# EAGLE design sm200-bob-v00 (EAGLE 5.11)
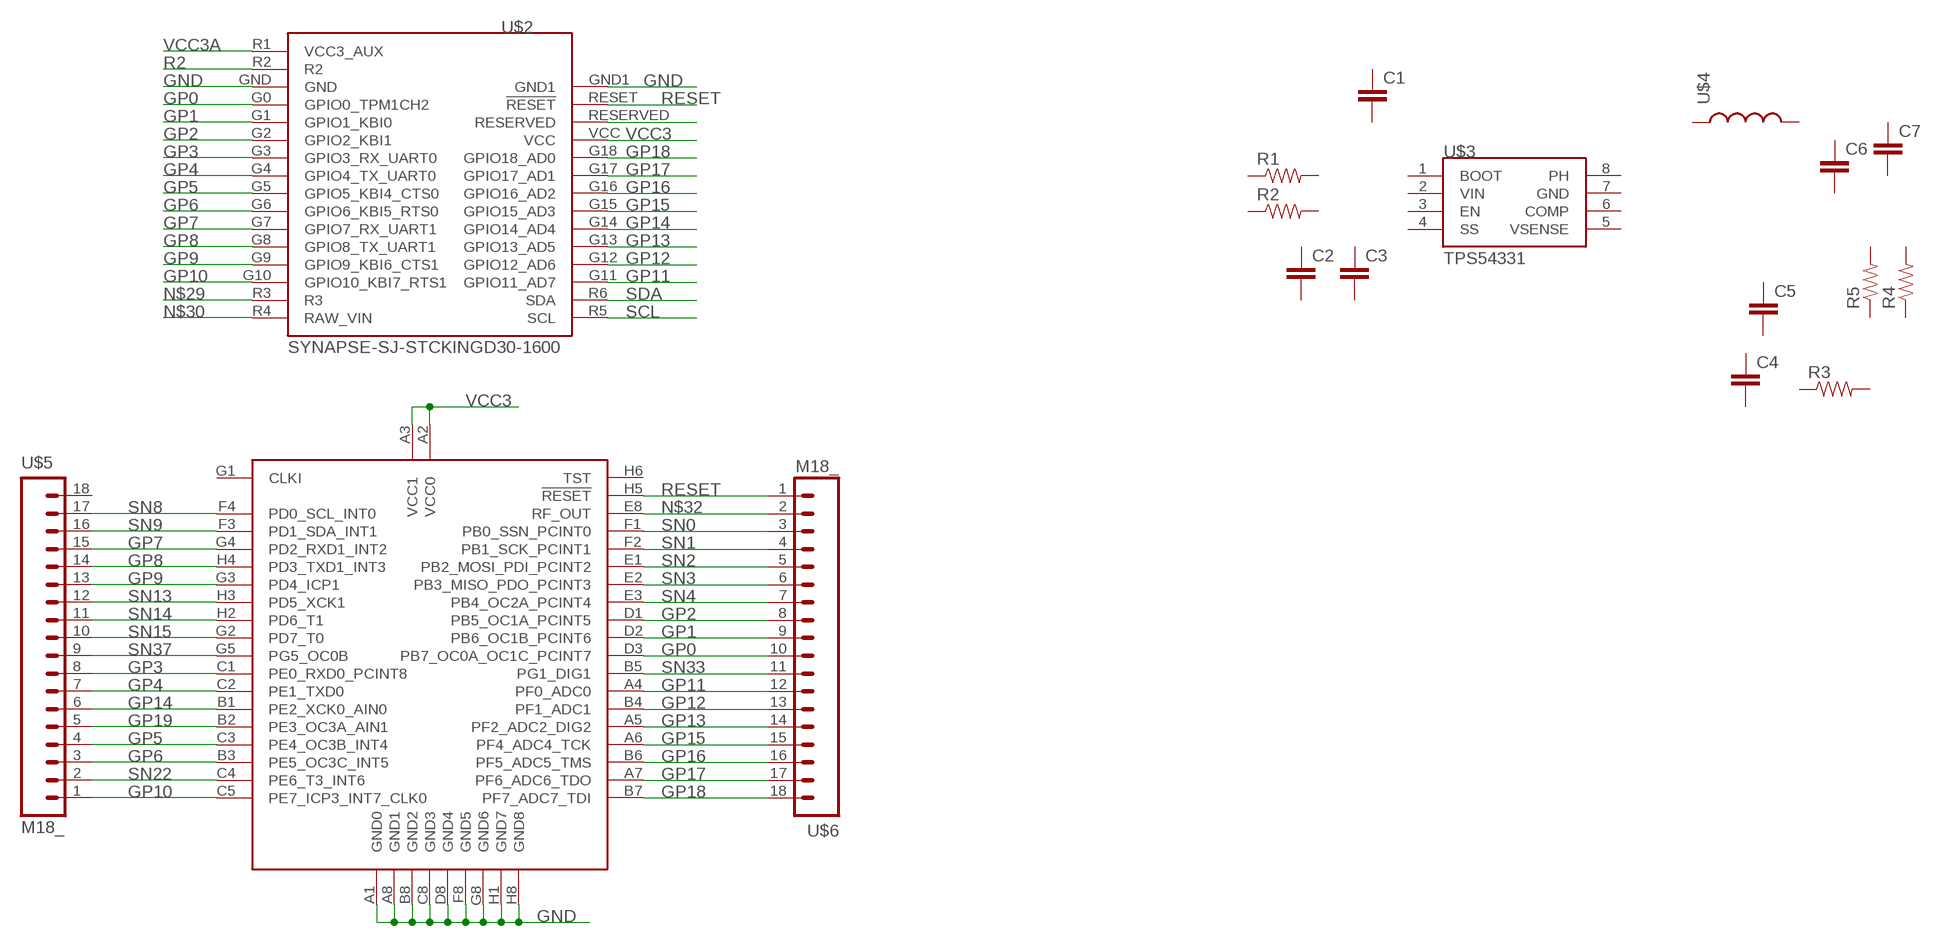
[diagram p0: schematic, sheet 1]

## Parts
C1  CAP0805  [0805]
C2  CAP0805  [0805]
C3  CAP0805  [0805]
C4  CAP0805  [0805]
C5  CAP0805  [0805]
C6  CAP0805  [0805]
C7  CAP0805  [0805]
R1  RESISTOR  [0805]
R2  RESISTOR  [0805]
R3  RESISTOR  [0805]
R4  RESISTOR  [0805]
R5  RESISTOR  [0805]
U$1  SM200SM-SILK  [SM200-PADS-SILK]
U$2  SYNAPSE-SJ-STCKINGD30-1600  [SYNSJ-STACK]
U$3  TPS54331  [DGK-R-PDSO-G8]
U$4  INDUCTOR1206H*  [INDUCTOR-1206]
U$5  M18_  [1X18]
U$6  M18_  [1X18]

## Nets
GND: U$1.A1(GND0) U$1.A8(GND1) U$1.B8(GND2) U$1.C8(GND3) U$1.D8(GND4) U$1.F8(GND5) U$1.G8(GND6) U$1.H1(GND7) U$1.H8(GND8) U$2.GND U$2.GND1
GP0: U$1.D3(PB7_OC0A_OC1C_PCINT7) U$2.G0(GPIO0_TPM1CH2) U$6.10
GP1: U$1.D2(PB6_OC1B_PCINT6) U$2.G1(GPIO1_KBI0) U$6.9
GP2: U$1.D1(PB5_OC1A_PCINT5) U$2.G2(GPIO2_KBI1) U$6.8
GP3: U$1.C1(PE0_RXD0_PCINT8) U$2.G3(GPIO3_RX_UART0) U$5.8
GP4: U$1.C2(PE1_TXD0) U$2.G4(GPIO4_TX_UART0) U$5.7
GP5: U$1.C3(PE4_OC3B_INT4) U$2.G5(GPIO5_KBI4_CTS0) U$5.4
GP6: U$1.B3(PE5_OC3C_INT5) U$2.G6(GPIO6_KBI5_RTS0) U$5.3
GP7: U$1.G4(PD2_RXD1_INT2) U$2.G7(GPIO7_RX_UART1) U$5.15
GP8: U$1.H4(PD3_TXD1_INT3) U$2.G8(GPIO8_TX_UART1) U$5.14
GP9: U$1.G3(PD4_ICP1) U$2.G9(GPIO9_KBI6_CTS1) U$5.13
GP10: U$1.C5(PE7_ICP3_INT7_CLK0) U$2.G10(GPIO10_KBI7_RTS1) U$5.1
GP11: U$1.A4(PF0_ADC0) U$2.G11(GPIO11_AD7) U$6.12
GP12: U$1.B4(PF1_ADC1) U$2.G12(GPIO12_AD6) U$6.13
GP13: U$1.A5(PF2_ADC2_DIG2) U$2.G13(GPIO13_AD5) U$6.14
GP14: U$1.B1(PE2_XCK0_AIN0) U$2.G14(GPIO14_AD4) U$5.6
GP15: U$1.A6(PF4_ADC4_TCK) U$2.G15(GPIO15_AD3) U$6.15
GP16: U$1.B6(PF5_ADC5_TMS) U$2.G16(GPIO16_AD2) U$6.16
GP17: U$1.A7(PF6_ADC6_TDO) U$2.G17(GPIO17_AD1) U$6.17
GP18: U$1.B7(PF7_ADC7_TDI) U$2.G18(GPIO18_AD0) U$6.18
GP19: U$1.B2(PE3_OC3A_AIN1) U$2.RESERVED U$5.5
N$29: U$2.R3
N$30: U$2.R4(RAW_VIN)
N$32: U$1.E8(RF_OUT) U$6.2
R2: U$2.R2
RESET: U$1.H5(!RESET) U$2.RESET(!RESET) U$6.1
SCL: U$2.R5(SCL)
SDA: U$2.R6(SDA)
SN0: U$1.F1(PB0_SSN_PCINT0) U$6.3
SN1: U$1.F2(PB1_SCK_PCINT1) U$6.4
SN2: U$1.E1(PB2_MOSI_PDI_PCINT2) U$6.5
SN3: U$1.E2(PB3_MISO_PDO_PCINT3) U$6.6
SN4: U$1.E3(PB4_OC2A_PCINT4) U$6.7
SN8: U$1.F4(PD0_SCL_INT0) U$5.17
SN9: U$1.F3(PD1_SDA_INT1) U$5.16
SN13: U$1.H3(PD5_XCK1) U$5.12
SN14: U$1.H2(PD6_T1) U$5.11
SN15: U$1.G2(PD7_T0) U$5.10
SN22: U$1.C4(PE6_T3_INT6) U$5.2
SN33: U$1.B5(PG1_DIG1) U$6.11
SN37: U$1.G5(PG5_OC0B) U$5.9
VCC3: U$1.A2(VCC0) U$1.A3(VCC1) U$2.VCC
VCC3A: U$2.R1(VCC3_AUX)
Unconnected: C1.1 C1.2 C2.1 C2.2 C3.1 C3.2 C4.1 C4.2 C5.1 C5.2 C6.1 C6.2 C7.1 C7.2 R1.1 R1.2 R2.1 R2.2 R3.1 R3.2 R4.1 R4.2 R5.1 R5.2 U$1.G1(CLKI) U$1.H6(TST) U$3.1(BOOT) U$3.2(VIN) U$3.3(EN) U$3.4(SS) U$3.5(VSENSE) U$3.6(COMP) U$3.7(GND) U$3.8(PH) U$4.P$1 U$4.P$2 U$5.18

## Library data of the parts
C1-C7 = 0_jc-custom:CAP: Capacitor Standard 0603 ceramic capacitor, and 0.1" leaded capacitor.
R1-R5 = SparkFun:RESISTOR: Resistor Basic schematic elements and footprints for 0603, 1206, and PTH 1/10th watt (small) resistors.
U$1 = 0-jctesting:SM200
U$2 = 0_jc-custom:SYNAPSE-SJ-STCKING: Standard layout for expansion modules using Synapse Wireless boards
U$3 = 0_jc-custom:TPS54331
U$4 = SparkFun:INDUCTOR: Inductors Basic Inductor/Choke - 0603 and 1206. Footprints are not proven and vary greatly between part numbers.
U$5 U$6 = SparkFun:M18

## Board
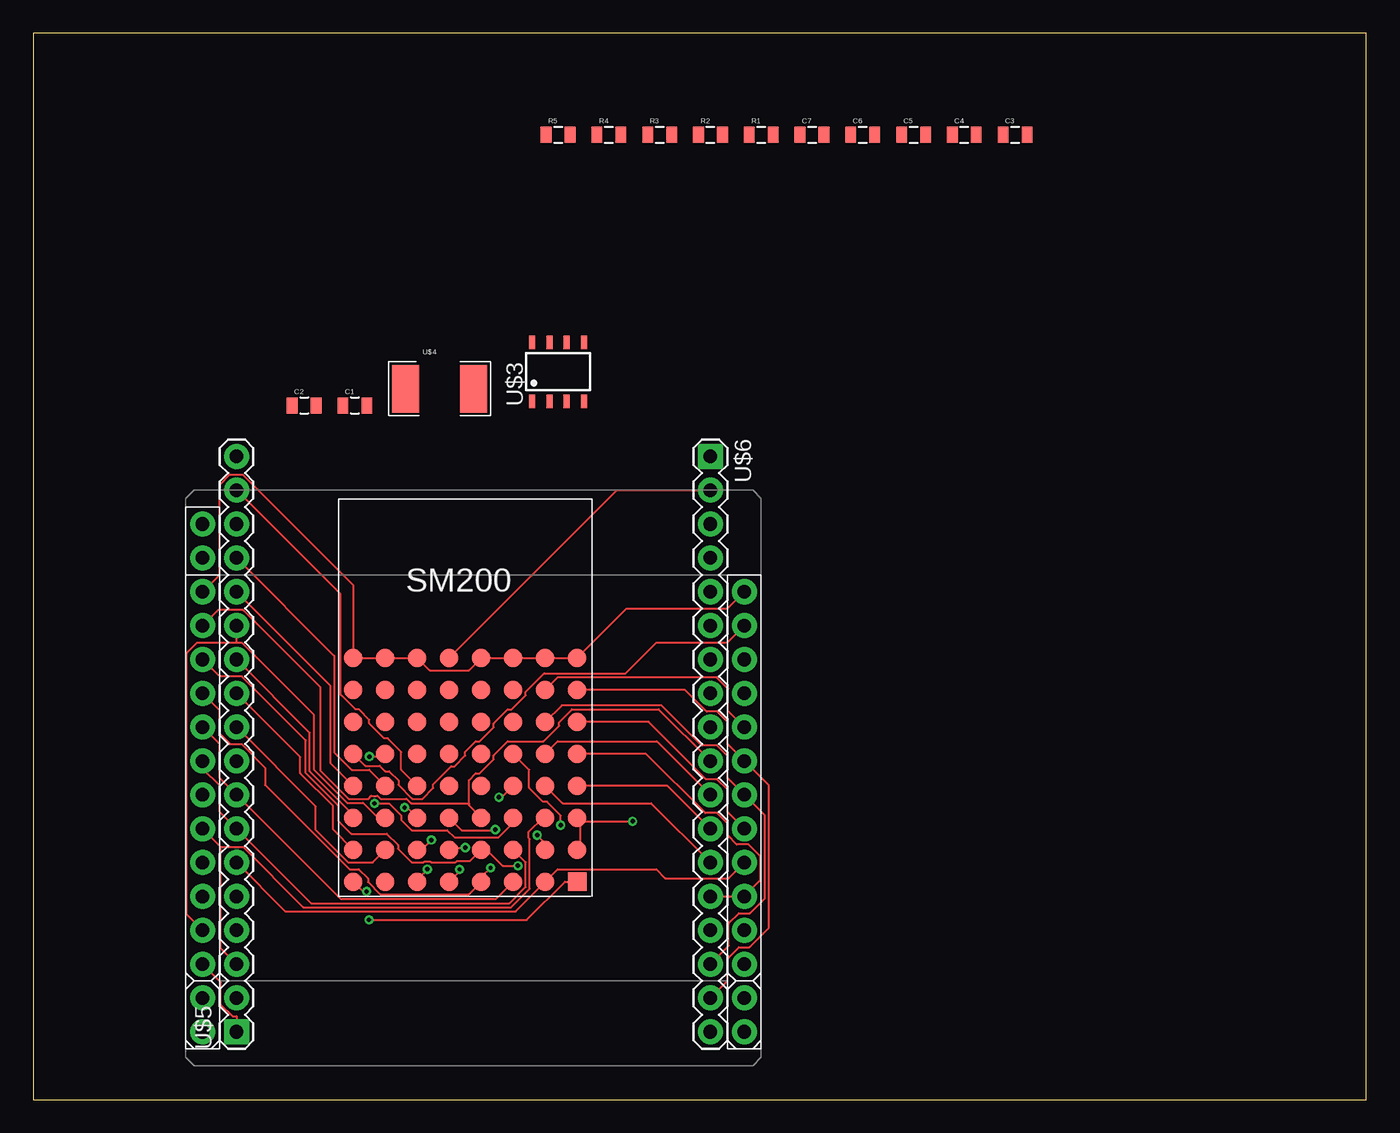
[diagram p1: board, top side]
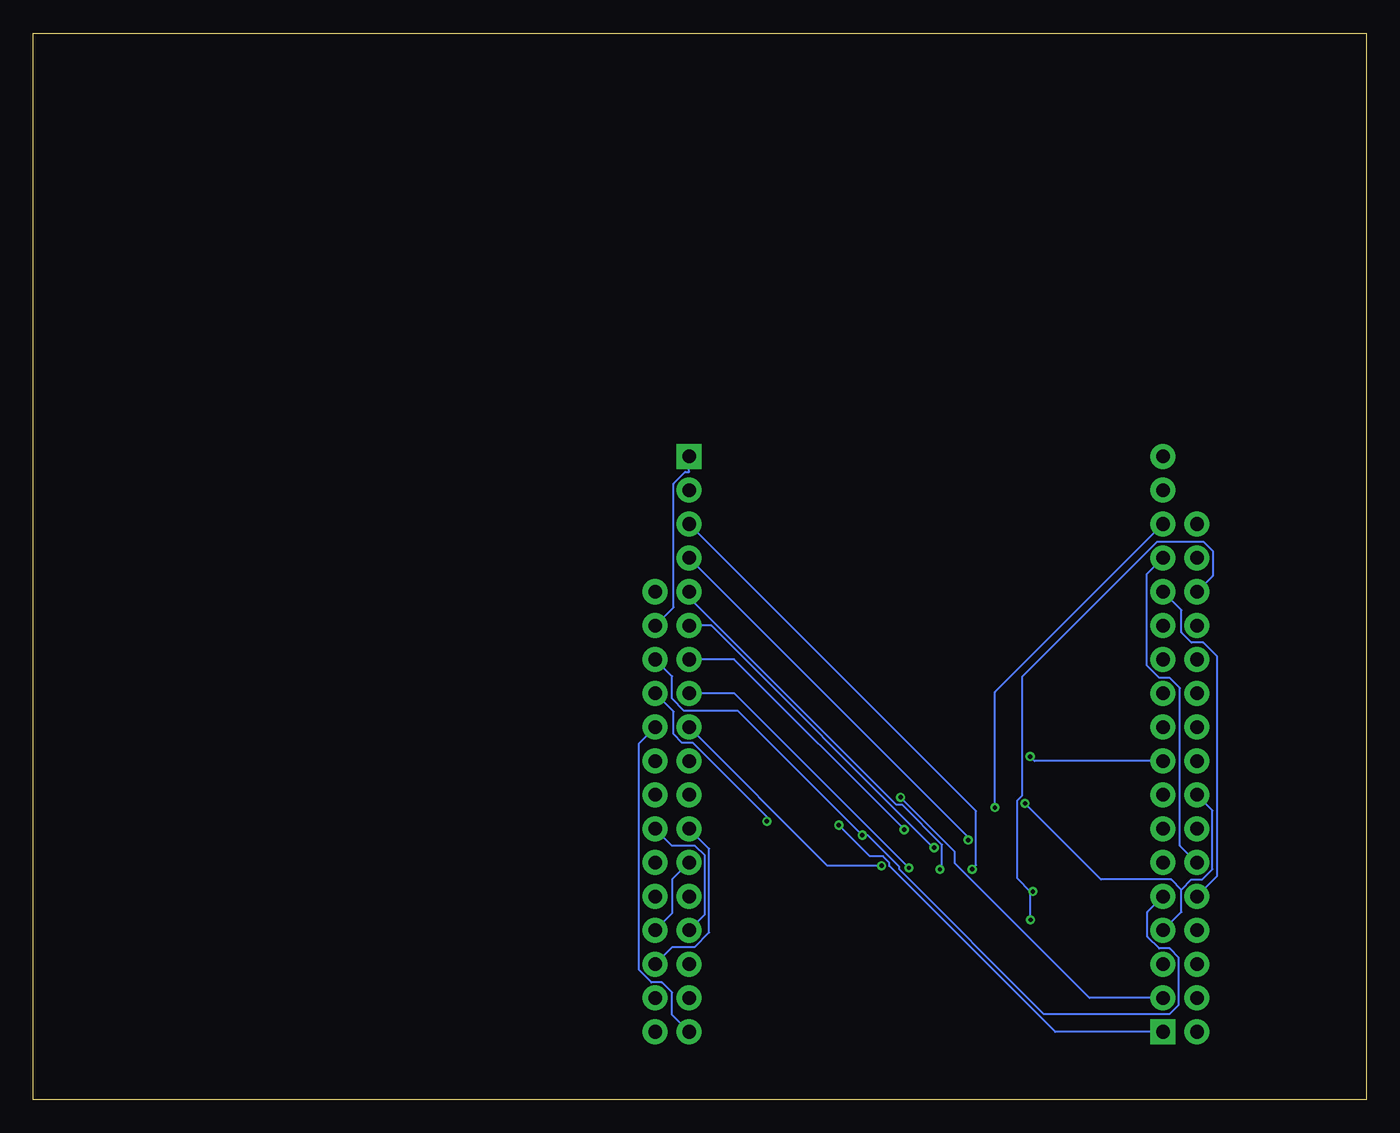
[diagram p2: board, bottom side, seen from below]

Size 100 x 80 mm. Coordinates in mm from the lower left corner, seen from the top.
Outline: 0,0 100,0 100,80 0,80 0,0
Copper layers (1*16): Top 0.0356mm / dielectric 1.5011mm / Bottom 0.0356mm
Design rules "LaenPCBOrder-JCModified": minimum track width 6mil, minimum drill 13mil, track to track 6mil, track to pad 6mil, pad to pad 6mil, via to via 6mil, smd to smd 6mil, copper to edge 15mil, drill to drill 6mil, minimum pad ring 12mil, minimum via ring 7mil, stop-mask expansion 4mil, vias tented up to drill 25mil, thermal gap 10mil

### Footprints (pad centres in the part's own frame; a part is rotated, then mirrored left to right if it is on the bottom)
0805 = smd 0.8 x 1.2: 1 -0.9,0; 2 0.9,0
SM200-PADS-SILK = smd 1.4 x 1.4: A1 1.1,1.1; A2 3.5,1.1; A3 5.9,1.1; A4 8.3,1.1; A5 10.7,1.1; A6 13.1,1.1; A7 15.5,1.1; A8 17.9,1.1; B1 1.1,3.5; B2 3.5,3.5; B3 5.9,3.5; B4 8.3,3.5; B5 10.7,3.5; B6 13.1,3.5; B7 15.5,3.5; B8 17.9,3.5; C1 1.1,5.9; C2 3.5,5.9; C3 5.9,5.9; C4 8.3,5.9; C5 10.7,5.9; C6 13.1,5.9; C7 15.5,5.9; C8 17.9,5.9; D1 1.1,8.3; D2 3.5,8.3; D3 5.9,8.3; D4 8.3,8.3; D5 10.7,8.3; D6 13.1,8.3; D7 15.5,8.3; D8 17.9,8.3; E1 1.1,10.7; E2 3.5,10.7; E3 5.9,10.7; E4 8.3,10.7; E5 10.7,10.7; E6 13.1,10.7; E7 15.5,10.7; E8 17.9,10.7; F1 1.1,13.1; F2 3.5,13.1; F3 5.9,13.1; F4 8.3,13.1; F5 10.7,13.1; F6 13.1,13.1; F7 15.5,13.1; F8 17.9,13.1; G1 1.1,15.5; G2 3.5,15.5; G3 5.9,15.5; G4 8.3,15.5; G5 10.7,15.5; G6 13.1,15.5; G7 15.5,15.5; G8 17.9,15.5; H1 1.1,17.9; H2 3.5,17.9; H3 5.9,17.9; H4 8.3,17.9; H5 10.7,17.9; H6 13.1,17.9; H7 15.5,17.9; H8 17.9,17.9
SYNSJ-STACK = drill 1.016 pad 1.88 round: G0 0,-7.62; G1 0,-10.16; G2 0,-12.7; G3 0,-15.24; G4 0,-17.78; G5 0,-20.32; G6 0,-22.86; G7 0,-25.4; G8 0,-27.94; G9 0,-30.48; G10 0,-33.02; G11 40.64,-33.02; G12 40.64,-30.48; G13 40.64,-27.94; G14 40.64,-25.4; G15 40.64,-22.86; G16 40.64,-20.32; G17 40.64,-17.78; G18 40.64,-15.24; GND 0,-5.08; GND1 40.64,-5.08; R1 0,0; R2 0,-2.54; R3 0,-35.56; R4 0,-38.1; R5 40.64,-38.1; R6 40.64,-35.56; RESERVED 40.64,-10.16; RESET 40.64,-7.62; VCC 40.64,-12.7
DGK-R-PDSO-G8 = smd 0.45 x 1: 1 -1.95,-2.21; 2 -0.65,-2.21; 3 0.65,-2.21; 4 1.95,-2.21; 5 1.95,2.21; 6 0.65,2.21; 7 -0.65,2.21; 8 -1.95,2.21
INDUCTOR-1206 = smd 2.032 x 3.556: P$1 -2.54,0; P$2 2.54,0
1X18 = drill 1.016 pad 1.88 square: 1 0,0 | drill 1.016 pad 1.88 round: 2 2.54,0; 3 5.08,0; 4 7.62,0; 5 10.16,0; 6 12.7,0; 7 15.24,0; 8 17.78,0; 9 20.32,0; 10 22.86,0; 11 25.4,0; 12 27.94,0; 13 30.48,0; 14 33.02,0; 15 35.56,0; 16 38.1,0; 17 40.64,0; 18 43.18,0

### Placement (x,y rotation side)
C1  24.13,52.07 0 top
C2  20.32,52.07 0 top
C3  73.66,72.39 0 top
C4  69.85,72.39 0 top
C5  66.04,72.39 0 top
C6  62.23,72.39 0 top
C7  58.42,72.39 0 top
R1  54.61,72.39 0 top
R2  50.8,72.39 0 top
R3  46.99,72.39 0 top
R4  43.18,72.39 0 top
R5  39.37,72.39 0 top
U$1  41.91,15.24 90 top
U$2  12.7,43.18 0 top
U$3  39.37,54.61 0 top
U$4  30.48,53.34 0 top
U$5  15.24,5.08 90 top
U$6  50.8,48.26 270 top

### Tracks (layer width: path | path; a pad name or v marks a point on that pad's centre or on a via)
GND  (via drill 0.33 pad 0.69)
  Top 0.152: v25.18,13.48 37.02,13.48 39.88,16.34 U$1.A1 | U$1.H1 24.74,15.61 v25.01,15.61 | U$2.GND 13.97,39.37 13.97,46.12 14.74,46.89 15.72,46.89 24.01,38.6 U$1.H8 U$1.G8 U$1.F8 29.74,32.21 32.68,32.21 U$1.D8 U$1.C8 U$1.B8 U$1.A8 44.5,36.83 52.07,36.83 U$2.GND1
  Bottom 0.152: v25.18,13.48 25.18,15.59 | 25.18,15.59 26.16,16.58 26.16,22.45 25.8,22.82 25.8,31.73 15.68,41.85 12.2,41.85 11.52,41.17 11.52,39.28 U$2.GND | 25.18,15.59 25.02,15.59 v25.01,15.61
GP0
  Top 0.152: 32.68,22.22 28.35,22.22 28,22.57 26.04,22.57 25.83,22.79 25.36,22.79 25.14,22.57 23.65,22.57 21.55,24.67 21.55,30.91 15.74,36.73 13.87,36.73 U$2.G0 | 32.68,22.22 32.68,22.07 U$1.D3 | U$6.10 46.92,29.27 40.42,29.27 39.45,28.31 39.45,28.05 38.27,26.87 35.59,26.87 34.54,25.82 34.54,25.52 33.49,24.47 33.19,24.47 32.68,23.96 32.68,22.22
GP1  (via drill 0.33 pad 0.69)
  Top 0.152: U$2.G1 13.97,31.75 15.63,31.75 20.43,26.95 20.43,24.5 22.91,22.02 22.91,20.88 23.85,19.94 26.52,19.94 27.36,19.1 27.36,18.82 28.39,17.8 29.27,17.8 29.33,17.85 29.8,17.85 29.85,17.8 31.69,17.8 31.78,17.89 32.76,17.89 U$1.D2 34.01,18.74 35.21,17.54 v36.36,17.54
  Bottom 0.152: U$6.9 40.4,17.54 v36.36,17.54
GP2  (via drill 0.33 pad 0.69)
  Top 0.152: U$2.G2 13.97,29.21 13.97,27.46 14.76,26.67 15.62,26.67 17.39,24.9 17.39,23.6 23.72,17.27 24.43,17.27 25.11,16.58 25.11,16.32 26.02,15.41 32.68,15.41 U$1.D1 33.61,16.69 v34.3,17.38
  Bottom 0.152: v34.3,17.38 47.4,30.48 U$6.8
GP3
  Top 0.152: U$2.G3 13.97,26.67 13.97,24.13 U$5.8 23.06,15.04 34.71,15.04 U$1.C1
GP4
  Top 0.152: U$2.G4 12.7,24.82 13.97,23.55 13.97,21.59 U$5.7 20.84,14.72 35.71,14.72 36.94,15.95 36.94,17.81 U$1.C2
GP5  (via drill 0.33 pad 0.69)
  Top 0.152: v25.59,22.21 26.7,22.21 27.61,21.3 27.61,20.99 28.39,20.21 31.05,20.21 31.59,19.67 34.91,19.67 36.01,20.77 U$1.C3
  Bottom 0.152: 13.87,15.75 13.11,16.51 12.3,16.51 11.53,17.29 11.53,21.69 U$2.G5 | U$5.4 13.87,14.07 13.87,15.75 | 13.87,15.75 14.63,16.51 19.89,16.51 v25.59,22.21
GP6
  Top 0.152: 14.05,18.95 15.72,18.95 20.25,14.42 35.85,14.42 37.24,15.82 37.24,19.55 37.17,19.62 37.17,20.08 38.23,21.14 U$1.B3 | U$2.G6 14.05,18.97 14.05,18.95 | U$5.3 14.05,11.35 14.05,18.95
GP7
  Top 0.152: U$5.15 22.59,33.29 22.59,26.04 23.88,24.74 25.21,24.74 U$1.G4
  Bottom 0.152: U$5.15 16.46,39.42 16.46,32.58 15.52,31.65 14.75,31.65 13.97,30.87 13.97,19.05 U$2.G7
GP8
  Top 0.152: U$5.14 22.28,31.06 22.28,25.27 U$1.H4
  Bottom 0.152: U$5.14 13.87,36.73 13.87,35.05 13.11,34.29 12.22,34.29 11.17,33.24 11.17,16.77 U$2.G8
GP9
  Top 0.152: 15.24,34.29 15.64,34.29 21.04,28.88 21.04,24.75 23.53,22.27 24.73,22.27 25.86,21.14 U$1.G3 | 15.24,34.29 12.31,34.29 11.51,33.49 11.51,13.89 U$2.G9 | 15.24,34.29 U$5.13
GP10  (via drill 0.33 pad 0.69)
  Top 0.152: v39.57,20.59 39.57,21.32 38.55,22.34 38.26,22.34 37.21,23.39 37.21,24.74 U$1.C5 | U$2.G10 14.07,8.79 14.07,7.12 14.95,6.25 15.24,6.25 U$5.1
  Bottom 0.152: U$5.1 23.34,5.08 35.77,17.51 35.77,17.77 36.25,18.25 37.23,18.25 v39.57,20.59
GP11
  Top 0.152: U$6.12 47.58,23.54 U$1.A4
  Bottom 0.152: U$6.12 49.3,18.82 49.3,12.53 50.41,11.43 52.07,11.43 U$2.G11
GP12
  Top 0.152: U$6.13 46.35,22.23 39.72,22.23 U$1.B4
  Bottom 0.152: U$6.13 52.07,16.51 52.07,13.97 U$2.G12
GP13
  Top 0.152: U$1.A5 45.96,25.94 50.41,21.49 51.3,21.49 52.07,20.72 52.07,19.84 52.77,19.13 53.66,19.13 54.56,18.23 54.56,16.46 U$2.G13 U$6.14
GP14
  Top 0.152: U$5.6 18.91,14.12 36.19,14.12 U$1.B1 39.34,17.27 46.74,17.27 47.4,16.61 52.16,16.61 U$2.G14
GP15
  Top 0.152: U$2.G15 52.07,21.59 52.07,23.26 51.3,24.03 50.47,24.03 46.16,28.34 U$1.A6
  Bottom 0.152: U$6.15 49.61,13.89 49.61,18.3 50.36,19.05 52.07,19.05 U$2.G15
GP16
  Top 0.152: U$1.B6 39.65,29.58 47.13,29.58 50.14,26.57 51.3,26.57 52.07,25.8 52.07,24.13 U$2.G16 54.88,21.32 54.88,15.08 53.77,13.97 52.93,13.97 52.17,13.21 52.17,11.53 U$6.16
GP17
  Top 0.152: U$6.17 52.07,8.89 52.07,10.56 52.94,11.43 53.72,11.43 55.18,12.89 55.18,23.56 U$2.G17 52.07,26.67 52.07,28.34 51.3,29.11 50.52,29.11 48.89,30.74 U$1.A7
GP18
  Top 0.152: U$2.G18 52.13,29.15 52.13,30.82 51.27,31.67 39.34,31.67 U$1.B7
  Bottom 0.152: U$6.18 52.07,6.35 52.07,8.03 52.83,8.79 53.62,8.79 54.55,9.72 54.55,26.73 U$2.G18
GP19  (via drill 0.33 pad 0.69)
  Top 0.152: U$1.B2 38.41,19.23 v37.8,19.83
  Bottom 0.152: U$5.5 16.41,14.07 16.41,12.21 15.53,11.33 14.75,11.33 14.06,10.64 14.06,7.11 14.76,6.41 24.17,6.41 35.03,17.27 35.03,17.47 37.39,19.83 v37.8,19.83 47.14,29.17 51.16,29.17 52.07,30.08 52.07,31.75 U$2.RESERVED
N$32
  Top 0.152: U$6.2 43.79,45.72 U$1.E8
RESET
  Top 0.152: U$2.RESET 52.07,34.29 46.75,34.29 44.44,31.98 38.33,31.98 36.94,30.59 36.94,30.32 35.89,29.27 35.59,29.27 34.54,28.22 34.54,27.92 33.49,26.87 33.19,26.87 32.41,26.09 32.41,25.8 31.62,25.01 31.36,25.01 30.01,23.66 30.01,23.38 29.21,22.57 28.43,22.57 27.39,23.62 27.39,23.95 26.71,24.63 26.4,24.63 25.99,25.05 24.91,25.05 U$1.H5
  Bottom 0.152: U$6.1 50.8,47.09 51.09,47.09 51.97,46.22 51.97,36.93 U$2.RESET
SN0  (via drill 0.33 pad 0.69)
  Top 0.152: v29.56,17.28 28.81,16.53 U$1.F1
  Bottom 0.152: U$6.3 29.27,21.65 29.27,17.57 v29.56,17.28
SN1  (via drill 0.33 pad 0.69)
  Top 0.152: v29.86,19.47 29.14,18.74 U$1.F2
  Bottom 0.152: U$6.4 29.86,19.7 v29.86,19.47
SN2  (via drill 0.33 pad 0.69)
  Top 0.152: U$1.E1 31.98,17.11 v31.98,17.27
  Bottom 0.152: v31.98,17.27 31.82,17.43 31.82,19.12 34.81,22.11 35.24,22.11 50.8,37.66 U$6.5
SN3  (via drill 0.33 pad 0.69)
  Top 0.152: v32.41,18.9 31.37,18.9 U$1.E2
  Bottom 0.152: v32.41,18.9 32.47,18.9 49.13,35.56 U$6.6
SN4  (via drill 0.33 pad 0.69)
  Top 0.152: v34.66,20.25 34.62,20.21 32.14,20.21 U$1.E3
  Bottom 0.152: U$6.7 47.43,33.02 v34.66,20.25
SN8
  Top 0.152: U$5.17 23.04,37.92 23.04,30.39 24.17,29.27 24.43,29.27 25.21,28.49 25.21,28.22 26.32,27.11 26.58,27.11 27.61,26.08 27.61,24.74 U$1.F4
SN9  (via drill 0.33 pad 0.69)
  Top 0.152: U$1.F3 28.04,21.91 v27.86,21.91
  Bottom 0.152: U$5.16 27.86,30.56 v27.86,21.91
SN13
  Top 0.152: U$5.12 20.74,27.52 20.74,24.63 24.01,21.36 U$1.H3
SN14
  Top 0.152: U$5.11 20.02,25.7 20.02,24.48 22.48,22.02 22.48,20.27 U$1.H2
SN15
  Top 0.152: U$5.10 21.19,21.99 21.19,20.23 23.63,17.79 25.46,17.79 U$1.G2
SN22  (via drill 0.33 pad 0.69)
  Top 0.152: U$1.C4 35.15,22.68 v34.94,22.68
  Bottom 0.152: U$5.2 20.76,7.62 30.86,17.72 30.86,18.6 v34.94,22.68
SN33
  Top 0.152: U$1.B5 39.34,26.88 46.78,26.88 U$6.11
SN37  (via drill 0.33 pad 0.69)
  Top 0.152: v25.21,25.73 26.2,25.73 U$1.G5
  Bottom 0.152: U$5.9 24.88,25.4 v25.21,25.73
VCC3  (via drill 0.33 pad 0.69)
  Top 0.152: 41.07,20.88 U$1.A3 | 41.07,20.88 v44.97,20.88 | 41.07,20.88 41.07,19 U$1.A2
  Bottom 0.152: U$2.VCC 51.97,29.11 51.97,27.42 51.32,26.77 50.52,26.77 44.97,21.22 v44.97,20.88